# Altium schematic sheet data_bridge.SchDoc
size A4; SheetNumber: 1; SheetTotal: 1
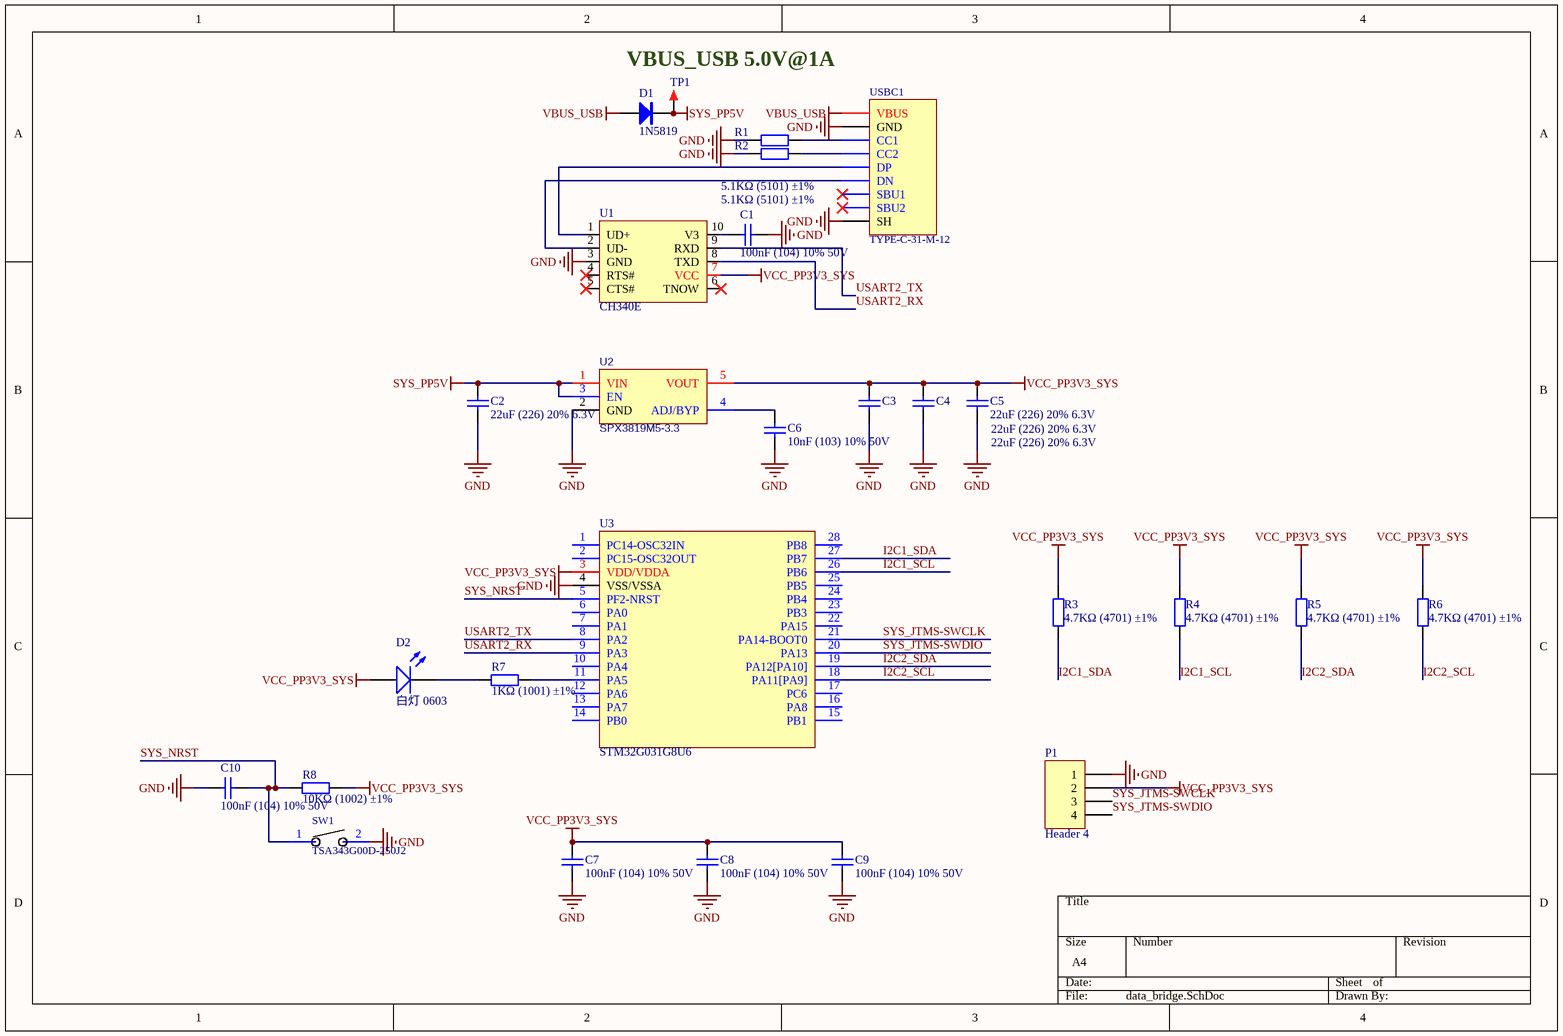
[diagram p0: data_bridge.SchDoc]

## Parts
C1  100nF (104) 10% 50V  [LC-0603_C_NOSILK]
C2  22uF (226) 20% 6.3V  [LC-0603_C_NOSILK]
C3  22uF (226) 20% 6.3V  [LC-0603_C_NOSILK]
C4  22uF (226) 20% 6.3V  [LC-0603_C_NOSILK]
C5  22uF (226) 20% 6.3V  [LC-0603_C_NOSILK]
C6  10nF (103) 10% 50V  [LC-0603_C_NOSILK]
C7  100nF (104) 10% 50V  [LC-0603_C_NOSILK]
C8  100nF (104) 10% 50V  [LC-0603_C_NOSILK]
C9  100nF (104) 10% 50V  [LC-0603_C_NOSILK]
C10  100nF (104) 10% 50V  [LC-0603_C_NOSILK]
D1  1N5819  [SOD-323]
D2  白灯 0603  [LC-0603_LED_S1]
P1  Header 4  [HDR2.54-LI-4P]
R1  5.1KΩ (5101) ±1%  [LC-0603_R_NOSILK]
R2  5.1KΩ (5101) ±1%  [LC-0603_R_NOSILK]
R3  4.7KΩ (4701) ±1%  [LC-0603_R_NOSILK]
R4  4.7KΩ (4701) ±1%  [LC-0603_R_NOSILK]
R5  4.7KΩ (4701) ±1%  [LC-0603_R_NOSILK]
R6  4.7KΩ (4701) ±1%  [LC-0603_R_NOSILK]
R7  1KΩ (1001) ±1%  [LC-0402_R_NOSILK]
R8  10KΩ (1002) ±1%  [LC-0603_R_NOSILK]
SW1  TSA343G00D-250J2  [SW-SMD_L4.0-W2.9-P4.15-EH]
TP1  TEST  [TEST 1]  (value not drawn)
U1  CH340E  [MSOP-10_L3.0-W3.0-P0.50-LS5.0-BL]
U2  SPX3819M5-3.3  [SOT-23-5_L2.9-W1.6-P0.95-LS2.8-BL]
U3  STM32G031G8U6  [UFQFPN-28_L4.0-W4.0-P0.50-BL]
USBC1  TYPE-C-31-M-12  [USB-C_SMD-TYPE-C-31-M-12]

## Nets
GND: C1.2 C2.1 C3.1 C4.1 C5.1 C6.1 C7.1 C8.1 C9.1 C10.1 P1.1 R1.1 R2.1 SW1.2 U1.3(GND) U2.2(GND) U3.4(VSS/VSSA) USBC1.0,1,2,3(SH) USBC1.A1,B1,A12,B12(GND)
SYS_PP5V: C2.2 D1.2(K) TP1.1 U2.1(VIN) U2.3(EN)
VBUS_USB: D1.1(A) USBC1.A4,A9,B4,B9(VBUS)
VCC_PP3V3_SYS: C3.2 C4.2 C5.2 C7.2 C8.2 C9.2 D2.A P1.2 R3.2 R4.2 R5.2 R6.2 R8.2 U1.7(VCC) U2.5(VOUT) U3.3(VDD/VDDA)
I2C1_SCL: R4.1 U3.26(PB6)
I2C1_SDA: R3.1 U3.27(PB7)
I2C2_SCL: R6.1 U3.18(PA11[PA9])
I2C2_SDA: R5.1 U3.19(PA12[PA10])
SYS_JTMS-SWCLK: P1.3 U3.21(PA14-BOOT0)
SYS_JTMS-SWDIO: P1.4 U3.20(PA13)
SYS_NRST: C10.2 R8.1 SW1.1 U3.5(PF2-NRST)
USART2_RX: U1.8(TXD) U3.9(PA3)
USART2_TX: U1.9(RXD) U3.8(PA2)
NetC1_1: C1.1 U1.10(V3)
NetC6_2: C6.2 U2.4(ADJ/BYP)
NetD2_K: D2.K R7.1
NetR1_2: R1.2 USBC1.A5(CC1)
NetR2_2: R2.2 USBC1.B5(CC2)
NetR7_2: R7.2 U3.11(PA5)
NetU1_1: U1.1(UD+) USBC1.A6,B6(DP)
NetU1_2: U1.2(UD-) USBC1.A7,B7(DN)

Not connected (* = marked no-connect by the designer): U1 4(RTS#)* 5(CTS#)* 6(TNOW)*; U3 1(PC14-OSC32IN) 2(PC15-OSC32OUT) 6(PA0) 7(PA1) 10(PA4) 12(PA6) 13(PA7) 14(PB0) 15(PB1) 16(PA8) 17(PC6) 22(PA15) 23(PB3) 24(PB4) 25(PB5) 28(PB8); USBC1 A8(SBU1)* B8(SBU2)*

## Notes on the sheet
- VBUS_USB 5.0V@1A

## Library data of the parts
C1 C7-C10 = 0603 100nF (104) 10% 50V: 贴片电容; ComponentLink1Description: 供应商链接; ComponentLink1URL: http://www.szlcsc.com/product/details_15331.html; Package: 0603; Supplier: LC; SuppliersPartNumber: C14663
C2-C5 = 0603 22uF (226) 20% 6.3V: 贴片电容; ComponentLink1Description: 供应商链接; ComponentLink1URL: http://www.szlcsc.com/product/details_60514.html; Package: 0603; Supplier: LC; SuppliersPartNumber: C59461
C6 = 0603 10nF (103) 10% 50V: 贴片电容; ComponentLink1Description: 供应商链接; ComponentLink1URL: http://www.szlcsc.com/product/details_58143.html; Package: 0603; Supplier: LC; SuppliersPartNumber: C57112
D1 = 1N5819: 肖特基二极管; 版权归属: 源创客; 属性: 40V/2A; BOM名称: 肖特基二极管; 学习资源: www.ooocke.com
D2 = 0603 白灯: 发光二极管; ComponentLink1Description: 供应商链接; ComponentLink1URL: http://www.szlcsc.com/product/details_2663.html; Package: 0603; Supplier: LC; SuppliersPartNumber: C2290
P1 = Header 4: Header, 4-Pin; LatestRevisionDate: 17-Jul-2002; LatestRevisionNote: Re-released for DXP Platform.; Publisher: Altium Limited
R1 R2 = 0603 5.1KΩ (5101) 1%: 贴片电阻; ComponentLink1Description: 供应商链接; ComponentLink1URL: http://www.szlcsc.com/product/details_23913.html; Package: 0603; Supplier: LC; SuppliersPartNumber: C23186
R3-R6 = 0603 4.7KΩ (4701) 1%: 贴片电阻; ComponentLink1Description: 供应商链接; ComponentLink1URL: http://www.szlcsc.com/product/details_23889.html; Package: 0603; Supplier: LC; SuppliersPartNumber: C23162
R7 = 0402 1KΩ (1001) 1%: 贴片电阻; ComponentLink1Description: 供应商链接; ComponentLink1URL: http://www.szlcsc.com/product/details_12256.html; Package: 0402; Supplier: LC; SuppliersPartNumber: C11702
R8 = 0603 10KΩ (1002) 1%: 贴片电阻; ComponentLink1Description: 供应商链接; ComponentLink1URL: http://www.szlcsc.com/product/details_26547.html; Package: 0603; Supplier: LC; SuppliersPartNumber: C25804
SW1 = TSA343G00D-250J2: 龟仔开关; BOM_Manufacturer: BRIGHT; Contributor: LCSC; BOM_Supplier: LCSC; BOM_Supplier Part: C354947; BOM_Manufacturer Part: TSA343G00D-250J2; spicePre: S; spiceSymbolName: TSA343G00D-250J2
TP1 = TEST: 测试点; 版权归属: 源创客; BOM名称: 测试点; 学习资源: www.ooocke.com
U1 = CH340E: ttl-usb芯片; BOM_Manufacturer: WCH(南京沁恒); BOM_Supplier: LCSC; BOM_Manufacturer Part: CH340E; BOM_Supplier Part: C99652; BOM_JLCPCB Part Class: Extended Part; spicePre: U; spiceSymbolName: CH340E
U2 = SPX3819M5-3.3: Vin=16V Vout=3.3V 500mA LDO; BOM_Manufacturer: null; Contributor: lcsc; BOM_Supplier: LCSC; BOM_Supplier Part: C9900018941; BOM_Manufacturer Part: SPX3819M5-3.3; BOM_JLCPCB Part Class: Extended Part; spicePre: U; spiceSymbolName: SPX3819M5-3.3
U3 = STM32G031G8U6: 主流Arm Cortex-M0+ MCU，具有64 KB Flash存储器、8 KB RAM、64 MHz CPU、2x USART、定时器、ADC和通信接口，1.7-3.6V; Manufacturer: ST(意法半导体); Contributor: LCSC; Supplier: LCSC; Supplier Part: C432211; Manufacturer Part: STM32G031G8U6; JLCPCB Part Class: Extended Part; spicePre: U; spiceSymbolName: STM32G031G8U6
USBC1 = TYPE-C-31-M-12: 贴片type-c母座; BOM_Manufacturer: 韩国韩荣; Contributor: LCSC; BOM_Supplier: LCSC; BOM_Supplier Part: C165948; BOM_Manufacturer Part: TYPE-C-31-M-12; BOM_JLCPCB Part Class: Extended Part; spicePre: U; spiceSymbolName: TYPE-C-31-M-12